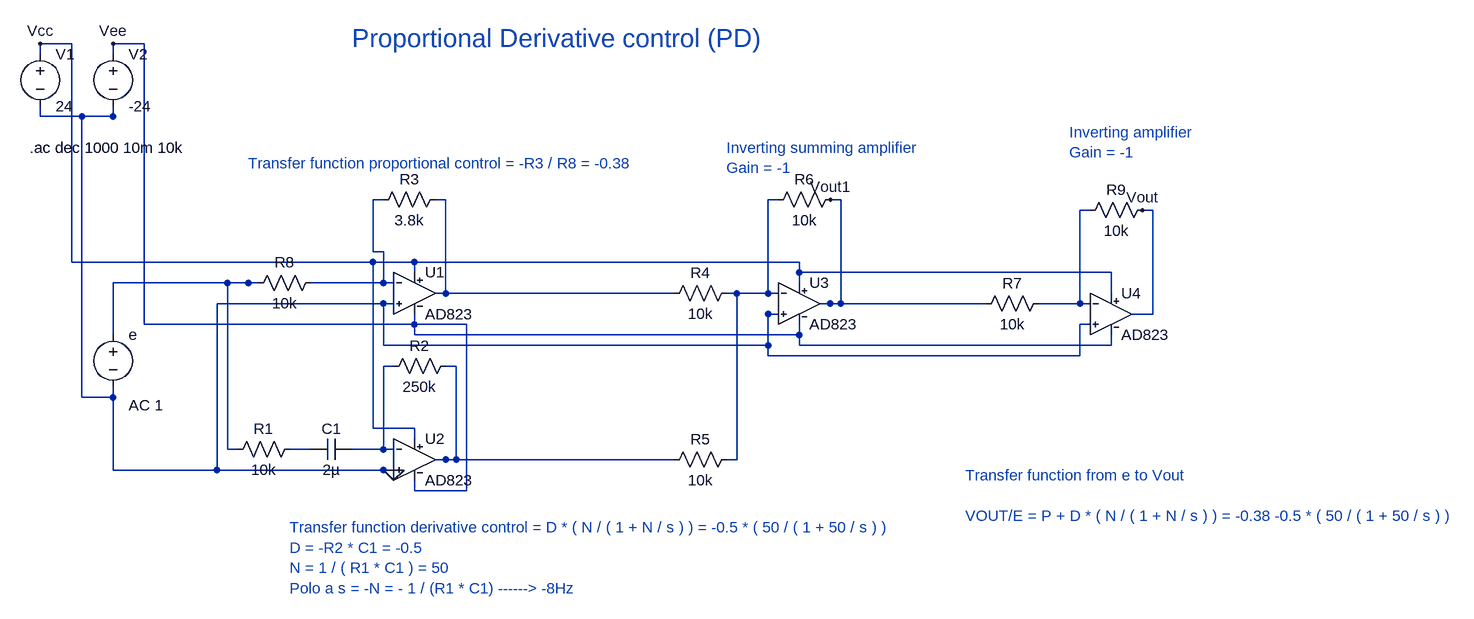
[diagram p0: schematic PD-controller.asc]
PD-controller.asc, the LTspice schematic file:
Version 4.1
SHEET 1 1788 680
WIRE 176 112 160 112
WIRE 176 368 160 368
WIRE 768 128 752 128
WIRE 1248 144 1232 144
WIRE -368 -192 -368 -176
WIRE -256 -192 -256 -176
WIRE -256 240 -256 256
WIRE 160 112 -96 112
WIRE -96 112 -96 368
WIRE -96 368 160 368
WIRE 160 368 -256 368
WIRE -256 368 -256 256
WIRE -256 256 -304 256
WIRE -304 256 -304 -176
WIRE -304 -176 -256 -176
WIRE -256 -176 -368 -176
WIRE 160 112 160 176
WIRE 160 176 752 176
WIRE 752 176 752 128
WIRE 752 128 752 192
WIRE 752 192 1232 192
WIRE 1232 192 1232 144
FLAG 176 368 0
WIRE 160 -48 144 -48
WIRE 48 80 64 80
WIRE 176 80 160 80
WIRE 144 -48 144 32
WIRE 144 32 160 32
WIRE 160 32 160 80
WIRE 160 80 64 80
WIRE 240 -48 256 -48
WIRE 608 96 592 96
WIRE 240 96 256 96
WIRE 256 -48 256 96
WIRE 256 96 592 96
WIRE 688 96 704 96
WIRE 688 352 704 352
WIRE 768 -48 752 -48
WIRE 768 96 752 96
WIRE 704 96 752 96
WIRE 752 96 752 -48
WIRE 704 96 704 352
WIRE 1168 112 1184 112
WIRE 1248 -32 1232 -32
WIRE 1248 112 1232 112
WIRE 1184 112 1232 112
WIRE 1232 112 1232 -32
WIRE -64 336 -80 336
WIRE -32 80 -48 80
WIRE -256 160 -256 144
WIRE -80 336 -80 80
WIRE -80 80 -48 80
WIRE -48 80 -256 80
WIRE -256 80 -256 144
WIRE 112 336 128 336
WIRE 176 208 160 208
WIRE 176 336 160 336
WIRE 128 336 160 336
WIRE 160 336 160 208
WIRE 256 208 272 208
WIRE 608 352 592 352
WIRE 240 352 256 352
WIRE 272 208 272 352
WIRE 272 352 256 352
WIRE 256 352 592 352
WIRE 48 336 32 336
WIRE 16 336 32 336
WIRE 208 64 208 48
WIRE 208 320 208 304
WIRE 800 80 800 64
WIRE 1280 96 1280 80
WIRE -368 -272 -368 -288
WIRE 208 48 144 48
WIRE 144 48 144 304
WIRE 144 304 208 304
WIRE 208 48 800 48
WIRE 800 48 800 64
WIRE 800 64 1280 64
WIRE 1280 64 1280 80
WIRE 208 48 -320 48
WIRE -320 48 -320 -288
WIRE -320 -288 -368 -288
FLAG -368 -288 Vcc
WIRE 208 128 208 144
WIRE 208 384 208 400
WIRE 800 144 800 160
WIRE 1280 160 1280 176
WIRE -256 -272 -256 -288
WIRE 208 144 288 144
WIRE 288 144 288 400
WIRE 288 400 208 400
WIRE 208 144 208 160
WIRE 208 160 800 160
WIRE 800 160 800 176
WIRE 800 176 1280 176
WIRE 208 144 -208 144
WIRE -208 144 -208 -288
WIRE -208 -288 -256 -288
FLAG -256 -288 Vee
WIRE 1328 -32 1344 -32
WIRE 1312 128 1328 128
WIRE 1344 -32 1344 128
WIRE 1344 128 1328 128
FLAG 1328 -32 Vout
WIRE 848 -48 864 -48
WIRE 1088 112 1072 112
WIRE 832 112 848 112
WIRE 864 -48 864 112
WIRE 864 112 848 112
WIRE 848 112 1072 112
FLAG 848 -48 Vout1
SYMBOL Opamps\\AD823A 208 32 R0
SYMATTR InstName U1
SYMBOL Opamps\\AD823A 208 288 R0
SYMATTR InstName U2
SYMBOL res -48 96 R270
WINDOW 0 32 56 VTop 2
WINDOW 3 0 56 VBottom 2
SYMATTR InstName R8
SYMATTR Value 10k
SYMBOL res 160 224 R270
WINDOW 0 32 56 VTop 2
WINDOW 3 0 56 VBottom 2
SYMATTR InstName R2
SYMATTR Value 250k
SYMBOL res 144 -32 R270
WINDOW 0 32 56 VTop 2
WINDOW 3 0 56 VBottom 2
SYMATTR InstName R3
SYMATTR Value 3.8k
SYMBOL res 592 112 R270
WINDOW 0 32 56 VTop 2
WINDOW 3 0 56 VBottom 2
SYMATTR InstName R4
SYMATTR Value 10k
SYMBOL res 592 368 R270
WINDOW 0 32 56 VTop 2
WINDOW 3 0 56 VBottom 2
SYMATTR InstName R5
SYMATTR Value 10k
SYMBOL res 752 -32 R270
WINDOW 0 32 56 VTop 2
WINDOW 3 0 56 VBottom 2
SYMATTR InstName R6
SYMATTR Value 10k
SYMBOL Opamps\\AD823A 800 48 R0
SYMATTR InstName U3
SYMBOL cap 112 320 R90
WINDOW 0 0 32 VBottom 2
WINDOW 3 32 32 VTop 2
SYMATTR InstName C1
SYMATTR Value 2µ
SYMBOL voltage -368 -288 R0
WINDOW 123 0 0 Left 2
WINDOW 39 0 0 Left 2
SYMATTR InstName V1
SYMATTR Value 24
SYMBOL voltage -256 -288 R0
WINDOW 123 0 0 Left 2
WINDOW 39 0 0 Left 2
SYMATTR InstName V2
SYMATTR Value -24
SYMBOL voltage -256 144 R0
WINDOW 123 24 124 Left 2
WINDOW 39 0 0 Left 2
SYMATTR Value2 AC 1
SYMATTR InstName e
SYMATTR Value ""
SYMBOL res -80 352 R270
WINDOW 0 32 56 VTop 2
WINDOW 3 0 56 VBottom 2
SYMATTR InstName R1
SYMATTR Value 10k
SYMBOL res 1072 128 R270
WINDOW 0 32 56 VTop 2
WINDOW 3 0 56 VBottom 2
SYMATTR InstName R7
SYMATTR Value 10k
SYMBOL res 1232 -16 R270
WINDOW 0 32 56 VTop 2
WINDOW 3 0 56 VBottom 2
SYMATTR InstName R9
SYMATTR Value 10k
SYMBOL Opamps\\AD823A 1280 64 R0
SYMATTR InstName U4
TEXT -384 -128 Left 2 !.ac dec 1000 10m 10k
TEXT -48 -104 Left 2 ;Transfer function proportional control = -R3 / R8 = -0.38
TEXT 16 456 Left 2 ;Transfer function derivative control = D * ( N / ( 1 + N / s ) ) = -0.5 * ( 50 / ( 1 + 50 / s ) )\nD = -R2 * C1 = -0.5\nN = 1 / ( R1 * C1 ) = 50\nPolo a s = -N = - 1 / (R1 * C1) ------> -8Hz
TEXT 112 -296 Left 4 ;Proportional Derivative control (PD)
TEXT 688 -128 Left 2 ;Inverting summing amplifier\nGain = -1
TEXT 1216 -152 Left 2 ;Inverting amplifier\nGain = -1
TEXT 1056 376 Left 2 ;Transfer function from e to Vout\n \nVOUT/E = P + D * ( N / ( 1 + N / s ) ) = -0.38 -0.5 * ( 50 / ( 1 + 50 / s ) )

The netlist it stands for:
* PD-controller.asc
X§U1 0 N001 Vcc Vee N002 AD823  ; pins In+ In- V+ V- OUT
X§U2 0 N006 Vcc Vee N007 AD823  ; pins In+ In- V+ V- OUT
R8 N005 N001 10k
R2 N006 N007 250k
R3 N001 N002 3.8k
R4 N002 N003 10k
R5 N007 N003 10k
R6 N003 Vout1 10k
X§U3 0 N003 Vcc Vee Vout1 AD823  ; pins In+ In- V+ V- OUT
C1 N006 N008 2µ
V1 Vcc 0 24
V2 Vee 0 -24
V§e N005 0 AC 1
R1 N005 N008 10k
R7 Vout1 N004 10k
R9 N004 Vout 10k
X§U4 0 N004 Vcc Vee Vout AD823  ; pins In+ In- V+ V- OUT
.ac dec 1000 10m 10k
* Transfer function proportional control = -R3 / R8 = -0.38
* Transfer function derivative control = D * ( N / ( 1 + N / s ) ) = -0.5 * ( 50 / ( 1 + 50 / s ) )
* D = -R2 * C1 = -0.5
* N = 1 / ( R1 * C1 ) = 50
* Polo a s = -N = - 1 / (R1 * C1) ------> -8Hz
* Proportional Derivative control (PD)
* Inverting summing amplifier
* Gain = -1
* Inverting amplifier
* Gain = -1
* Transfer function from e to Vout
* VOUT/E = P + D * ( N / ( 1 + N / s ) ) = -0.38 -0.5 * ( 50 / ( 1 + 50 / s ) )
.lib ADI.lib
.backanno
.end